# Altium project 20240611-SMARTCAGE-PCB-V2.PrjPcb
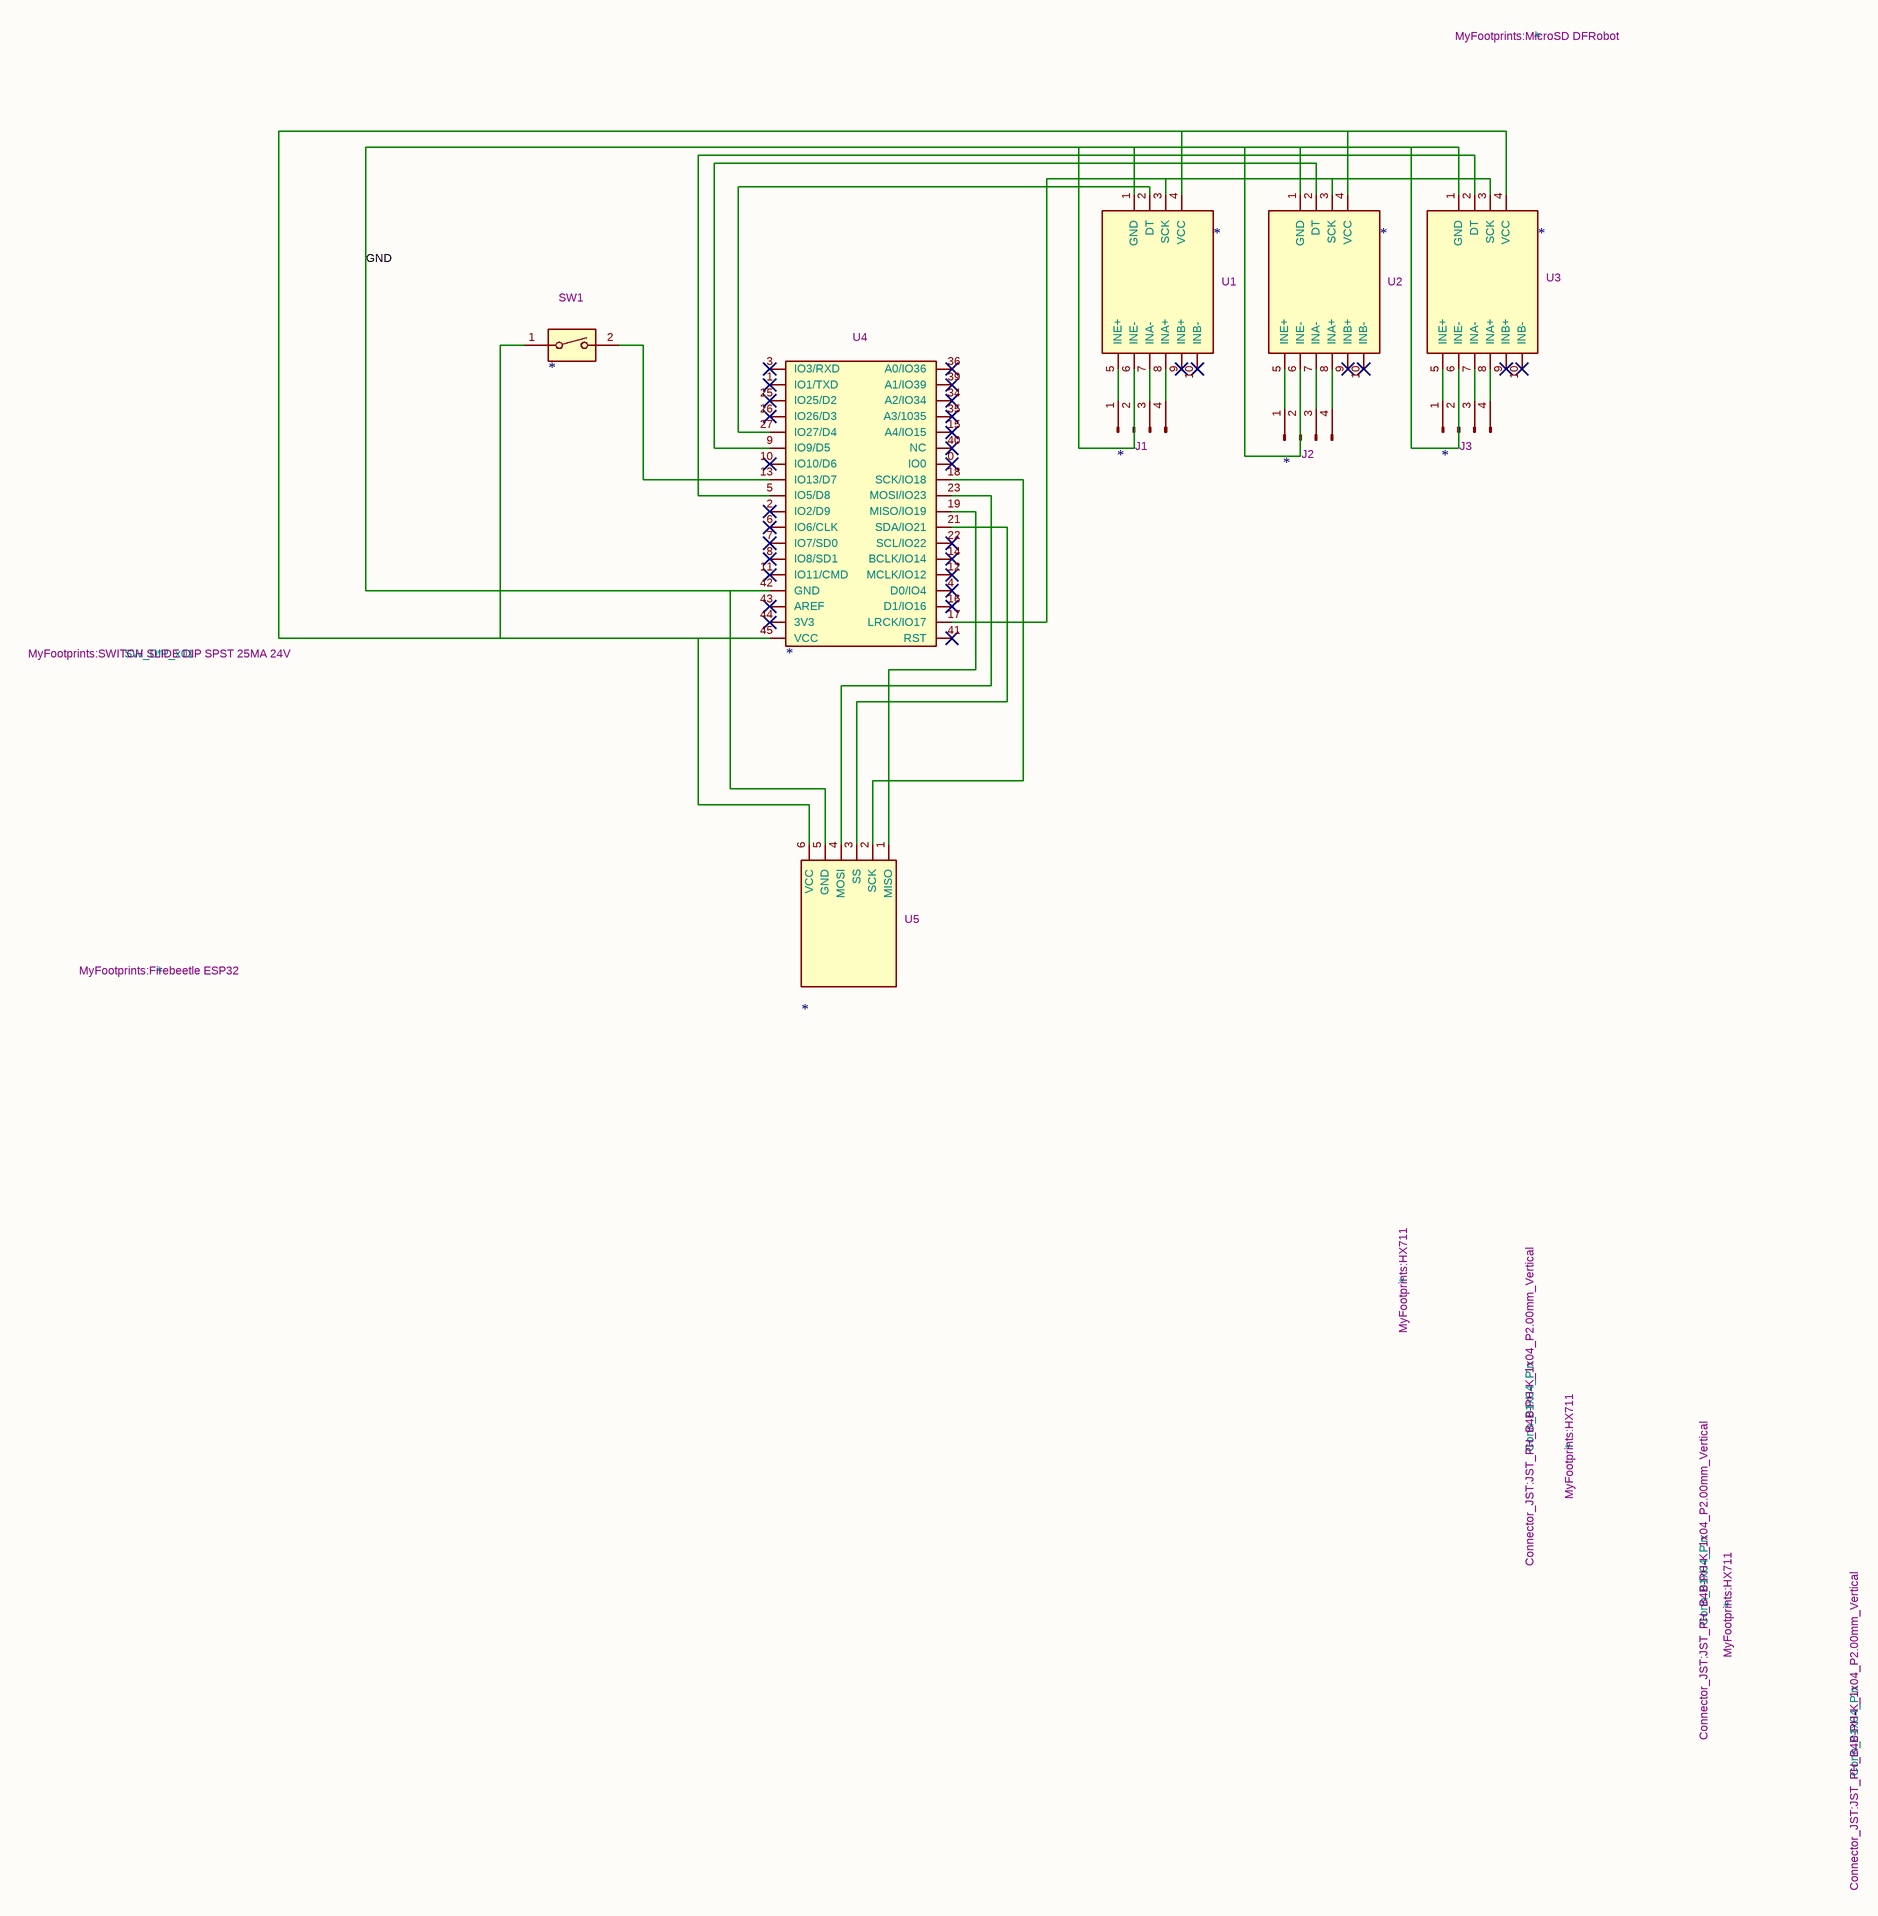
[diagram p0: 20240611-SMARTCAGE-PCB-V2.SchDoc]
1 sheet, 9 parts. Net scope: global (net labels, ports and power ports of the same name join across sheets).
Board files: 20240611-SMARTCAGE-PCB-V2.PcbDoc, 20240611-SMARTCAGE-PCB-V2(1).PcbDoc

## Sheet 20240611-SMARTCAGE-PCB-V2.SchDoc
size 420 x 297 mm

### Parts
(Parts that share a designator on the sheet are numbered #1, #2 ... from top to bottom, then left to right.)
*#1  *  value ~  Reference: U1  Footprint: MyFootprints:HX711
*#2  *  value ~  Reference: U2  Footprint: MyFootprints:HX711
*#3  *  value ~  Reference: U3  Footprint: MyFootprints:HX711
*#4  *  value SW_DIP_x01  Reference: SW1  Footprint: MyFootprints:SWITCH SLIDE DIP SPST 25MA 24V
*#5  *  value Conn_01x04_Pin  Reference: J1  Footprint: Connector_JST:JST_PH_B4B-PH-K_1x04_P2.00mm_Vertical
*#6  *  value Conn_01x04_Pin  Reference: J3  Footprint: Connector_JST:JST_PH_B4B-PH-K_1x04_P2.00mm_Vertical
*#7  *  value Conn_01x04_Pin  Reference: J2  Footprint: Connector_JST:JST_PH_B4B-PH-K_1x04_P2.00mm_Vertical
*#8  *  value ~  Reference: U4  Footprint: MyFootprints:Firebeetle ESP32
*#9  *  value ~  Reference: U5  Footprint: MyFootprints:MicroSD DFRobot

### Nets
GND: *#1.1(GND) *#1.6(INE-) *#2.1(GND) *#2.6(INE-) *#3.1(GND) *#3.6(INE-) *#5.2(Pin_2) *#6.2(Pin_2) *#7.2(Pin_2) *#8.42(GND) *#9.5(GND)
Net*#1_2: *#1.2(DT) *#8.27(IO27/D4)
Net*#1_3: *#1.3(SCK) *#2.3(SCK) *#3.3(SCK) *#8.17(LRCK/IO17)
Net*#1_4: *#1.4(VCC) *#2.4(VCC) *#3.4(VCC) *#4.1 *#8.45(VCC) *#9.6(VCC)
Net*#1_5: *#1.5(INE+) *#5.1(Pin_1)
Net*#1_7: *#1.7(INA-) *#5.3(Pin_3)
Net*#1_8: *#1.8(INA+) *#5.4(Pin_4)
Net*#2_2: *#2.2(DT) *#8.9(IO9/D5)
Net*#2_5: *#2.5(INE+) *#7.1(Pin_1)
Net*#2_7: *#2.7(INA-) *#7.3(Pin_3)
Net*#2_8: *#2.8(INA+) *#7.4(Pin_4)
Net*#3_2: *#3.2(DT) *#8.5(IO5/D8)
Net*#3_5: *#3.5(INE+) *#6.1(Pin_1)
Net*#3_7: *#3.7(INA-) *#6.3(Pin_3)
Net*#3_8: *#3.8(INA+) *#6.4(Pin_4)
Net*#4_2: *#4.2 *#8.13(IO13/D7)
Net*#8_18: *#8.18(SCK/IO18) *#9.2(SCK)
Net*#8_19: *#8.19(MISO/IO19) *#9.1(MISO)
Net*#8_21: *#8.21(SDA/IO21) *#9.3(SS)
Net*#8_23: *#8.23(MOSI/IO23) *#9.4(MOSI)

Not connected (* = marked no-connect by the designer): *#1 9(INB+)* 10(INB-)*; *#2 9(INB+)* 10(INB-)*; *#3 9(INB+)* 10(INB-)*; *#8 0(IO0)* 1(IO1/TXD)* 2(IO2/D9)* 3(IO3/RXD)* 4(D0/IO4)* 6(IO6/CLK)* 7(IO7/SD0)* 8(IO8/SD1)* 10(IO10/D6)* 11(IO11/CMD)* 12(MCLK/IO12)* 14(BCLK/IO14)* 15(A4/IO15)* 16(D1/IO16)* 22(SCL/IO22)* 25(IO25/D2)* 26(IO26/D3)* 34(A2/IO34)* 35(A3/1035)* 36(A0/IO36)* 39(A1/IO39)* 40(NC)* 41(RST)* 43(AREF)* 44(3V3)*

### Notes on the sheet
- 1
- 2
- 3
- 4
- 5
- 6
- 7
- 8
- A
- B
- C
- D
- E
- Title: Premier PCB pour la Smart Cage
- File: 20240611-SMARTCAGE-PCB-V2.kicad_sch
- Sheet: /
- Valérie PINEAU NOËL
- F
- KiCad E.D.A.  kicad (5.1.4)-1
- Size: A3
- Date:
- Rev:
- Id: 1/1

### Library data of the parts
*#1-*#3 = HX711_1
*#4 = SW_DIP_x01: Datasheet: ~
*#5-*#7 = Conn_01x04_Pin: Datasheet: ~
*#8 = Firebeetle_ESP-32
*#9 = MicroSD_Module_V1.0_DFRobot